# Altium schematic sheet Top+Board_V1.schdoc
size 280 x 192 mm
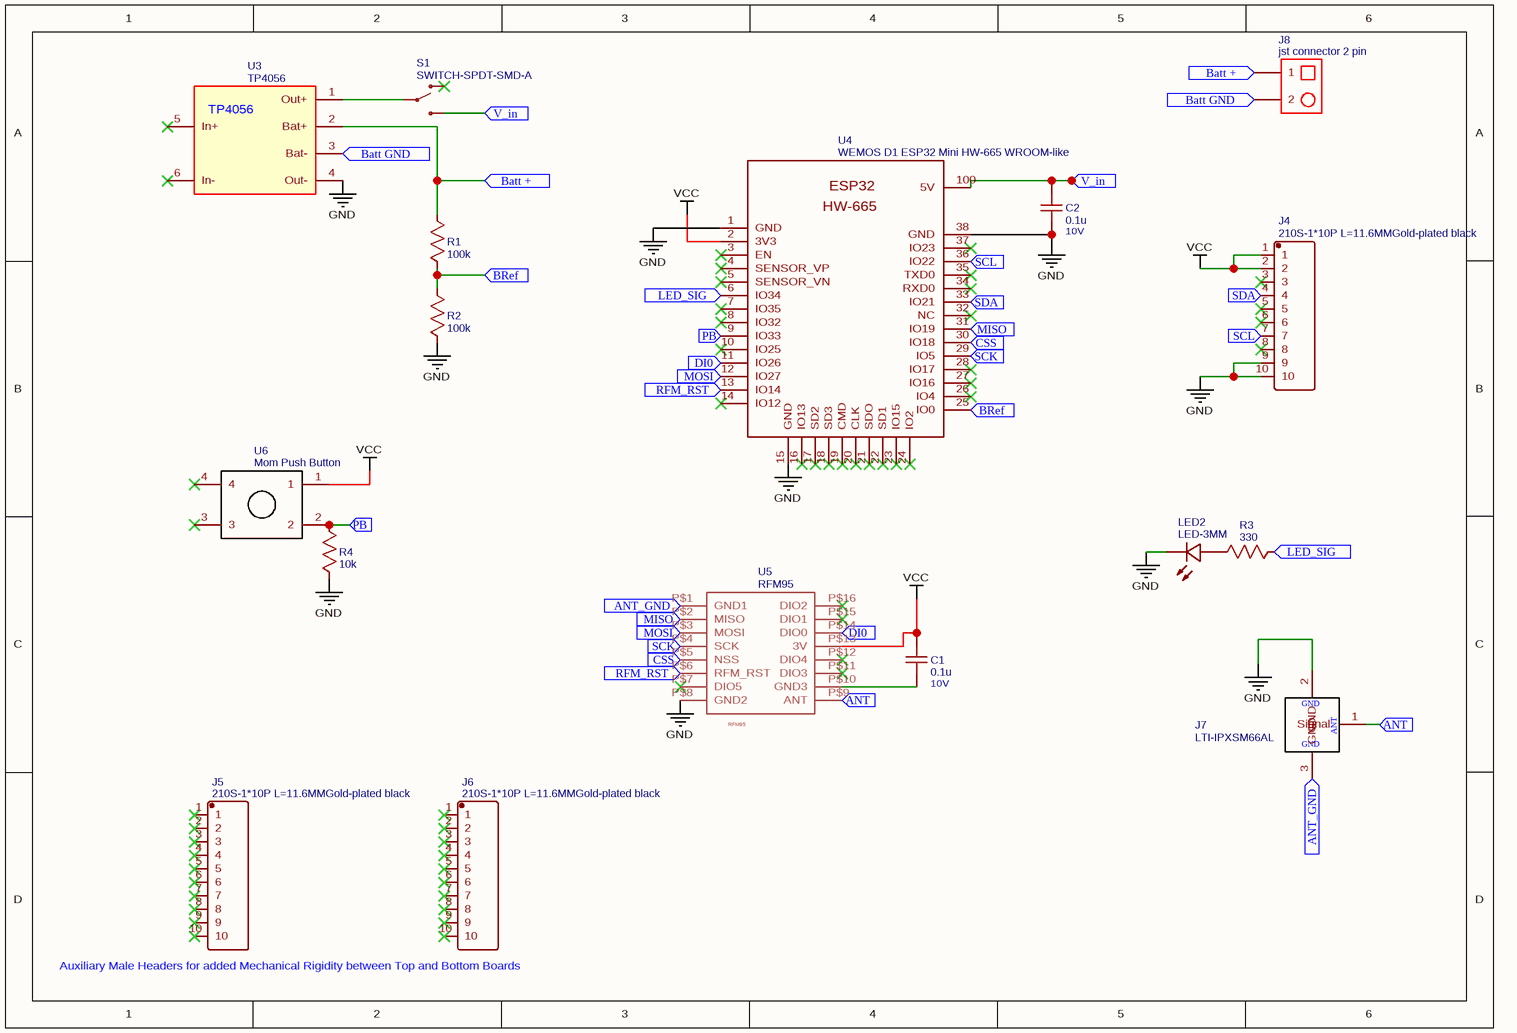
[diagram p0: Top+Board_V1.schdoc]

## Parts
C1  0.1u  [0805]
C2  0.1u  [0805]
J4  210S-1*10P L=11.6MMGold-plated black  [210S-1X10P]
J5  210S-1*10P L=11.6MMGold-plated black  [210S-1X10P]
J6  210S-1*10P L=11.6MMGold-plated black  [210S-1X10P]
J7  LTI-IPXSM66AL  [LTI-IPXSM66AL]
J8  jst connector 2 pin  [JST_XH_02X2.50MM]
LED2  LED-3MM  [LED-3MM/2.54]
R1  100k  [0805]
R2  100k  [0805]
R3  330  [0805]
R4  10k  [0805]
S1  SWITCH-SPDT-SMD-A  [SWITCH-SPST-SMD-A]
U3  TP4056  [TP4056]
U4  WEMOS D1 ESP32 Mini HW-665 WROOM-like  [WEMOS D1 ESP32]
U5  RFM95  [RFM95]
U6  Mom Push Button  [MOMENTARY_BUTTON_PACKAGE]

## Ports
ANT, ANT_GND, Batt +, Batt GND, BRef, CSS, DI0, LED_SIG, MISO, MOSI, PB, RFM_RST, SCK, SCL, SDA, V_in

## Nets
GND: C2.1 J4.9 J4.10 J7.2(GND) LED2.2(-) R2.1 R4.1 U3.4(Out-) U4.1(GND) U4.15(GND) U4.38(GND) U5.P$8(GND2)
VCC: C1.2 J4.1 J4.2 U4.2(3V3) U5.P$13(3V) U6.1
ANT: J7.1(Signal) U5.P$9(ANT) ; port ANT
ANT_GND: J7.3(GND) U5.P$1(GND1) ; port ANT_GND
Batt +: J8.1 R1.2 U3.2(Bat+) ; port Batt +
Batt GND: J8.2 U3.3(Bat-) ; port Batt GND
BRef: R1.1 R2.2 U4.25(IO0) ; port BRef
CSS: U4.30(IO18) U5.P$5(NSS) ; port CSS
DI0: U4.11(IO26) U5.P$14(DIO0) ; port DI0
LED_SIG: R3.2 U4.6(IO34) ; port LED_SIG
MISO: U4.31(IO19) U5.P$2(MISO) ; port MISO
MOSI: U4.12(IO27) U5.P$3(MOSI) ; port MOSI
PB: R4.2 U4.9(IO33) U6.2 ; port PB
RFM_RST: U4.13(IO14) U5.P$6(RFM_RST) ; port RFM_RST
SCK: U4.29(IO5) U5.P$4(SCK) ; port SCK
SCL: J4.7 U4.36(IO22) ; port SCL
SDA: J4.4 U4.33(IO21) ; port SDA
V_in: C2.2 S1.3(S) U4.100(5V) ; port V_in
NetC1_1: C1.1 U5.P$10(GND3)
NetLED2_1: LED2.1(+) R3.1
NetS1_2: S1.2(P) U3.1(Out+)

Not connected (* = marked no-connect by the designer): J4 3* 5* 6* 8*; J5 1* 2* 3* 4* 5* 6* 7* 8* 9* 10*; J6 1* 2* 3* 4* 5* 6* 7* 8* 9* 10*; S1 1(O)*; U3 5(In+)* 6(In-)*; U4 3(EN)* 4(SENSOR_VP)* 5(SENSOR_VN)* 7(IO35)* 8(IO32)* 10(IO25)* 14(IO12)* 16(IO13)* 17(SD2)* 18(SD3)* 19(CMD)* 20(CLK)* 21(SDO)* 22(SD1)* 23(IO15)* 24(IO2)* 26(IO4)* 27(IO16)* 28(IO17)* 32(NC)* 34(RXD0)* 35(TXD0)* 37(IO23)*; U5 P$7(DIO5)* P$11(DIO3)* P$12(DIO4)* P$15(DIO1)* P$16(DIO2)*; U6 3* 4*

## Notes on the sheet
- (near C2) 10V
- (near C1) 10V
- (near J7) GND
- (near J7) SIG
- (near J7) ANT
- Auxiliary Male Headers for added Mechanical Rigidity between Top and Bottom Boards
- (in symbol WEMOS D1 ESP32 Mini HW-665 WROOM-like) ESP32; HW-665

## Library data of the parts
C1 C2 = 0.1u: nameAlias: Value(F); spicePre: C; spiceSymbolName: Cap_0805_US
J4-J6 = 210S-1*10P L=11.6MMGold-plated black: BOM_Manufacturer: Ckmtw; Contributor: LCSC; BOM_Supplier: LCSC; BOM_Manufacturer Part: 210S-1*10P L=11.6MMGold-plated black; BOM_Supplier Part: C124372; spicePre: H
J7 = LTI-IPXSM66AL: Contributor: hyperlogos; sourceId: UxvfBXjFC; spicePre: C
J8 = jst connector 2 pin: BOM_Manufacturer Part: JST_XH CONNECTOR; Contributor: j.arts87; link: https://nl.aliexpress.com/item/50-sets-Kit-in-doos-2-p-3-p-4-pin-2-54mm-Pitch-Terminal-Behuizing/32681086028.html?spm=a2g0s.9042311.0.0.I0g15Z; spicePre: U
LED2 = LED-3MM: BOM_Manufacturer: EVERLIGHT; BOM_Manufacturer Part: 204-10SURD/S530-A3; BOM_Supplier: LCSC; BOM_Supplier Part: C99772; spicePre: L
R1 R2 = 100k: nameAlias: Value(Ω); BOM_Manufacturer Part: ?; spicePre: R; spiceSymbolName: Res_0805(1/8W)_US
R3 = 330: nameAlias: Value(Ω); BOM_Manufacturer Part: ?; spicePre: R; spiceSymbolName: Res_0805(1/8W)_US
R4 = 10k: nameAlias: Value(Ω); BOM_Manufacturer Part: ?; spicePre: R; spiceSymbolName: Res_0805(1/8W)_US
S1 = SWITCH-SPDT-SMD-A: description: SPDT Switch; Contributor: SparkFun; BOM_Manufacturer Part: ?; spicePre: S
U3 = TP4056: Contributor: defdjamel2008; timeStamp: 1469261013; spicePre: U
U4 = WEMOS D1 ESP32 Mini HW-665 WROOM-like: Contributor: robdobsn; BOM_Manufacturer: WEMOS; BOM_Supplier: WEMOS; BOM_Supplier Part: WEMOS_D1_ESP32; spicePre: U
U5 = RFM95: Contributor: dcast78_eagle; spicePre: ?
U6 = Mom Push Button: BOM_Manufacturer Part: Momentary Push Button; Contributor: bschaden; spicePre: U